# Altium schematic sheet DS1307.SchDoc
size A; SheetNumber: 3; SheetTotal: 9
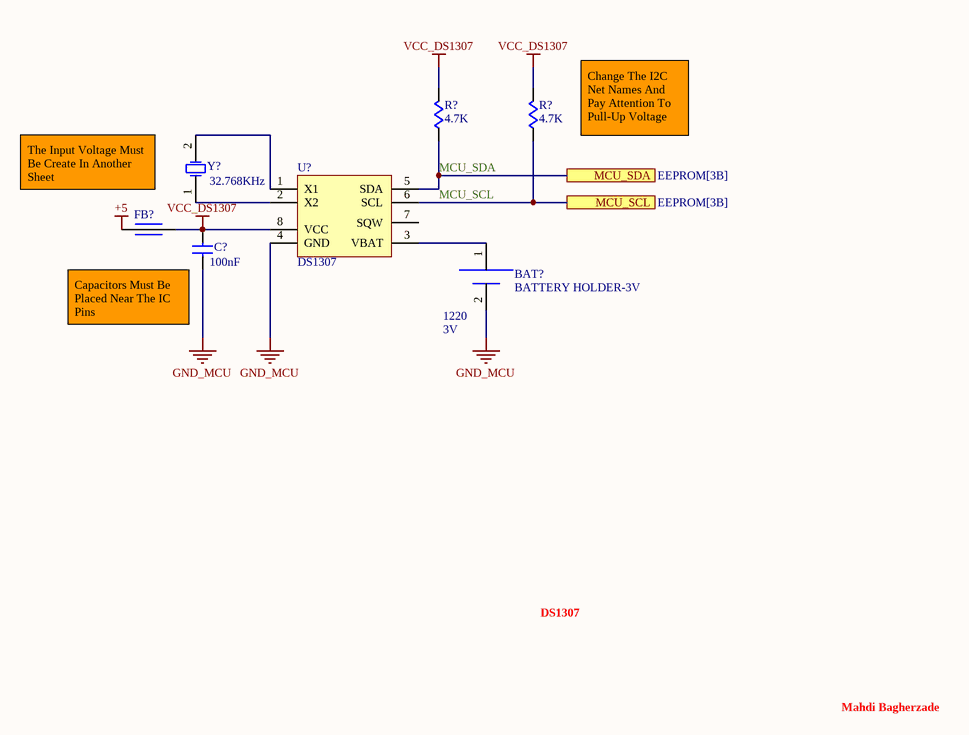
[diagram p0: DS1307.SchDoc]

## Parts
(Parts that share a designator on the sheet are numbered #1, #2 ... from top to bottom, then left to right.)
BAT?  BATTERY HOLDER-3V  Size: 1220  Voltage: 3V  [BAT-HOLDER-SMD-1220]
C?  value 100nF  [C-0805]
FB?  FERRITE BEAD  [FB-0805]  (value not drawn)
R?#1  value 4.7K  [R-0805]
R?#2  value 4.7K  [R-0805]
U?  DS1307  [SOIC8]
Y?  value 32.768KHz  [CRYSTAL-CLK-S]

## Ports
MCU_SCL (see EEPROM[3B]), MCU_SDA (see EEPROM[3B])

## Nets
+5: FB?.1
GND_MCU: BAT?.2(-) C?.1 U?.4(GND)
VCC_DS1307: C?.2 FB?.2 R?#1.2 R?#2.2 U?.8(VCC)
MCU_SCL: R?#2.1 U?.6(SCL) ; port MCU_SCL
MCU_SDA: R?#1.1 U?.5(SDA) ; port MCU_SDA
NetBAT?_1: BAT?.1(+) U?.3(VBAT)
NetU?_1: U?.1(X1) Y?.2(OSC2)
NetU?_2: U?.2(X2) Y?.1(OSC1)

Not connected (* = marked no-connect by the designer): U? 7(SQW)

## Notes on the sheet
- (near R?#2) Change The I2C Net Names And Pay Attention To Pull-Up Voltage
- The Input Voltage Must Be Create In Another Sheet
- (near C?) Capacitors Must Be Placed Near The IC Pins
- DS1307
- Mahdi Bagherzade

## Library data of the parts
BAT? = BATTERY HOLDER: BATTERY; Phone Number: 0915 8700 314; Publisher: Mahdi Bagherzadeh; ComponentLink1Description: Linkedin; ComponentLink1URL: https://ir.linkedin.com/in/mahdi-bagherzade; Published Date: 9-15-2024
C? = CAP-BIPOLAR: CAPACITOR; Phone Number: 0915 8700 314; Voltage: 50V; Publisher: Mahdi Bagherzadeh; ComponentLink1Description: Linkedin; ComponentLink1URL: https://ir.linkedin.com/in/mahdi-bagherzade; Published Date: 9-15-2024; Size: 0805
FB? = FERRITE BEAD: INDUCATOR; Phone Number: 0915 8700 314; Publisher: Mahdi Bagherzadeh; ComponentLink1Description: Linkedin; ComponentLink1URL: https://ir.linkedin.com/in/mahdi-bagherzade; Published Date: 9-15-2024
R?#1 R?#2 = RES: RESISTOR; Phone Number: 0915 8700 314; Tolerance: 5%; Power: 1/8W; Publisher: Mahdi Bagherzadeh; ComponentLink1Description: Linkedin; ComponentLink1URL: https://ir.linkedin.com/in/mahdi-bagherzade; Published Date: 9-15-2024
U? = DS1307: IC; Phone Number: 0915 8700 314; Publisher: Mahdi Bagherzadeh; ComponentLink1Description: Linkedin; ComponentLink1URL: https://ir.linkedin.com/in/mahdi-bagherzade; Published Date: 9-15-2024
Y? = CRYSTAL: Phone Number: 0915 8700 314; Publisher: Mahdi Bagherzadeh; ComponentLink1Description: Linkedin; ComponentLink1URL: https://ir.linkedin.com/in/mahdi-bagherzade; Published Date: 9-15-2024